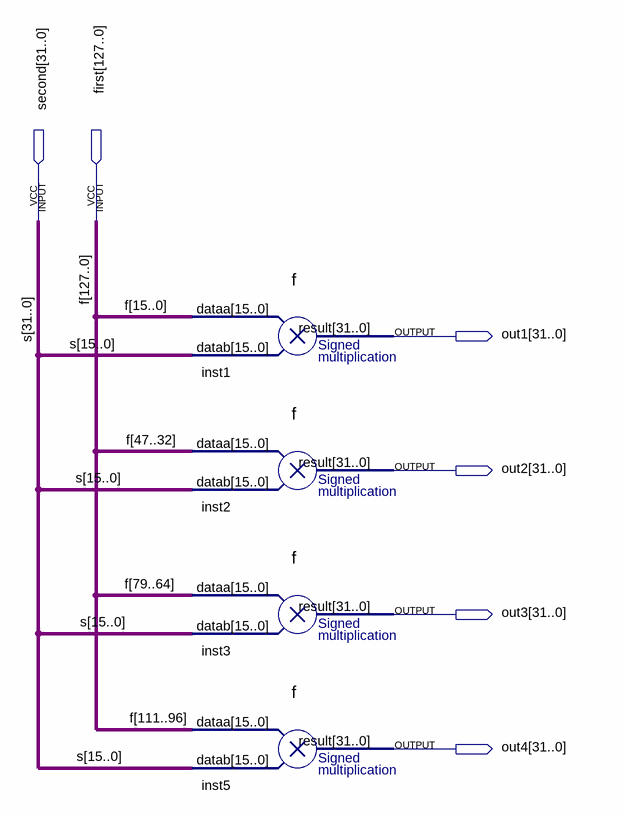
[diagram p0: schematic sheet]
// Quartus schematic MultiplierPolynomial_scalar.bdf as structural Verilog: 4 symbols, 6 pins
module MultiplierPolynomial_scalar (
  input  [31:0] second,
  input  [127:0] first,
  output [31:0] out1,
  output [31:0] out2,
  output [31:0] out3,
  output [31:0] out4
);

  f inst1 (.dataa(first[15:0]), .datab(second[15:0]), .result(out1));
  f inst2 (.dataa(first[47:32]), .datab(second[15:0]), .result(out2));
  f inst3 (.dataa(first[79:64]), .datab(second[15:0]), .result(out3));
  f inst5 (.dataa(first[111:96]), .datab(second[15:0]), .result(out4));

  // Other names for the same wires on the sheet: f[127:0] = first; s[31:0] = second
endmodule
